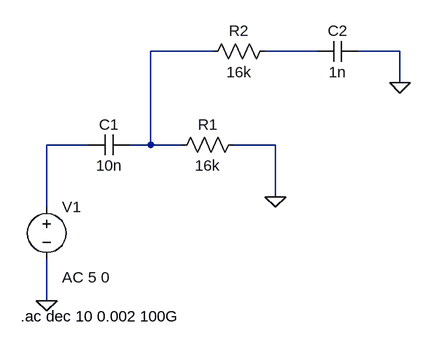
[diagram p0: schematic band_pass.asc]
band_pass.asc, the LTspice schematic file:
Version 4.1
SHEET 1 880 680
WIRE 336 -16 240 -16
WIRE 496 -16 416 -16
WIRE 624 -16 560 -16
WIRE 624 32 624 -16
WIRE 144 128 80 128
WIRE 240 128 240 -16
WIRE 240 128 208 128
WIRE 288 128 240 128
WIRE 432 128 368 128
WIRE 432 208 432 128
WIRE 80 224 80 128
WIRE 80 368 80 304
FLAG 432 208 0
FLAG 624 32 0
FLAG 80 368 0
SYMBOL cap 208 112 R90
WINDOW 0 0 32 VBottom 2
WINDOW 3 32 32 VTop 2
SYMATTR InstName C1
SYMATTR Value 10n
SYMBOL voltage 80 208 R0
WINDOW 123 24 124 Left 2
WINDOW 39 0 0 Left 0
SYMATTR InstName V1
SYMATTR Value ""
SYMATTR Value2 AC 5 0
SYMBOL res 384 112 R90
WINDOW 0 0 56 VBottom 2
WINDOW 3 32 56 VTop 2
SYMATTR InstName R1
SYMATTR Value 16k
SYMBOL res 432 -32 R90
WINDOW 0 0 56 VBottom 2
WINDOW 3 32 56 VTop 2
SYMATTR InstName R2
SYMATTR Value 16k
SYMBOL cap 560 -32 R90
WINDOW 0 0 32 VBottom 2
WINDOW 3 32 32 VTop 2
SYMATTR InstName C2
SYMATTR Value 1n
TEXT 40 392 Left 2 !.ac dec 10 0.002 100G

The netlist it stands for:
* band_pass.asc
C1 N001 N003 10n
V1 N003 0 AC 5 0
R1 0 N001 16k
R2 N002 N001 16k
C2 0 N002 1n
.ac dec 10 0.002 100G
.backanno
.end